# Altium project PCB.PrjPcb
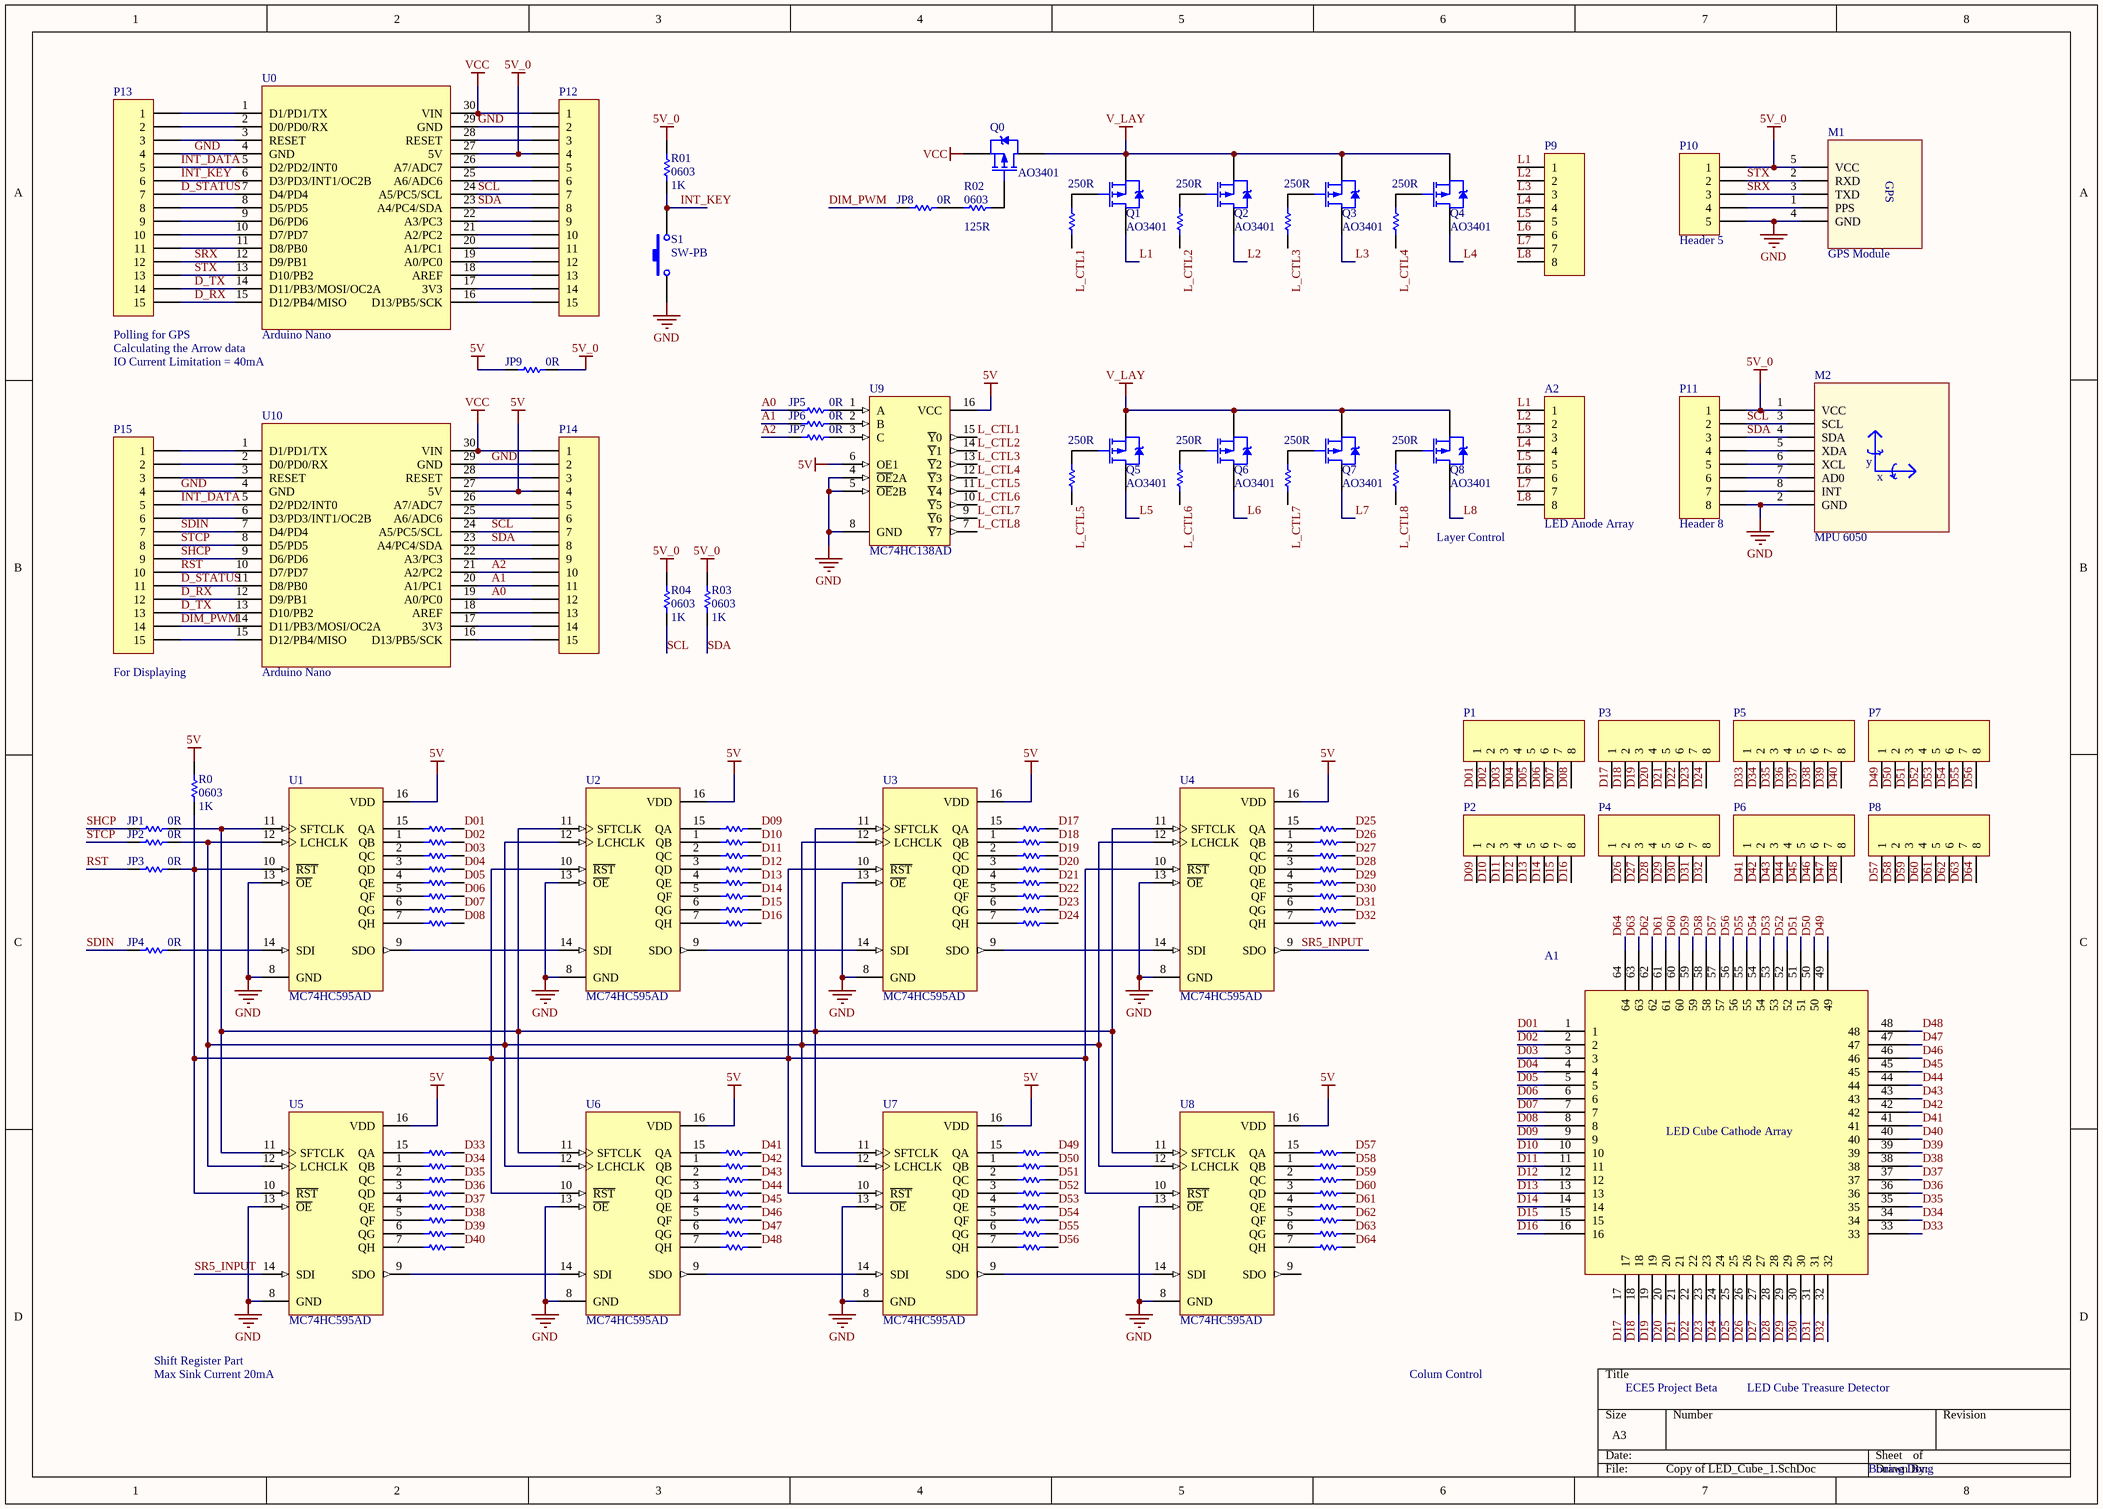
[diagram p0: Copy of LED_Cube_1.SchDoc]
1 sheet, 126 parts. Net scope: global (net labels, ports and power ports of the same name join across sheets).

## Sheet Copy of LED_Cube_1.SchDoc
size A3

### Parts
A1  LED Cube Cathode Array
A2  LED Anode Array  [HDR1X8]
JP1  value 0R  [AXIAL-0.3]  (hidden comment: 0603)
JP2  value 0R  [AXIAL-0.3]  (hidden comment: 0603)
JP3  value 0R  [AXIAL-0.3]  (hidden comment: 0603)
JP4  value 0R  [AXIAL-0.3]  (hidden comment: 0603)
JP5  value 0R  [AXIAL-0.3]  (hidden comment: 0603)
JP6  value 0R  [AXIAL-0.3]  (hidden comment: 0603)
JP7  value 0R  [AXIAL-0.3]  (hidden comment: 0603)
JP8  value 0R  [AXIAL-0.3]  (hidden comment: 0603)
JP9  value 0R  [AXIAL-0.3]  (hidden comment: 0603)
M1  GPS Module
M2  MPU 6050
P1  Header 8  [HDR1X8]  (value not drawn)
P2  Header 8  [HDR1X8]  (value not drawn)
P3  Header 8  [HDR1X8]  (value not drawn)
P4  Header 8  [HDR1X8]  (value not drawn)
P5  Header 8  [HDR1X8]  (value not drawn)
P6  Header 8  [HDR1X8]  (value not drawn)
P7  Header 8  [HDR1X8]  (value not drawn)
P8  Header 8  [HDR1X8]  (value not drawn)
P9  Header 8  [HDR1X8]  (value not drawn)
P10  Header 5  [HDR1X5]
P11  Header 8  [HDR1X8]
P12  Header 15  [HDR1X15]  (value not drawn)
P13  Header 15  [HDR1X15]  (value not drawn)
P14  Header 15  [HDR1X15]  (value not drawn)
P15  Header 15  [HDR1X15]  (value not drawn)
Q0  AO3401  [TO-220AB]
Q1  AO3401  [TO-220AB]
Q2  AO3401  [TO-220AB]
Q3  AO3401  [TO-220AB]
Q4  AO3401  [TO-220AB]
Q5  AO3401  [TO-220AB]
Q6  AO3401  [TO-220AB]
Q7  AO3401  [TO-220AB]
Q8  AO3401  [TO-220AB]
R0  0603  value 1K  [AXIAL-0.3]
R1  0603  [AXIAL-0.3]  (value not drawn)
R01  0603  value 1K  [AXIAL-0.3]
R2  0603  [AXIAL-0.3]  (value not drawn)
R02  0603  value 125R  [AXIAL-0.3]
R3  0603  [AXIAL-0.3]  (value not drawn)
R03  0603  value 1K  [AXIAL-0.3]
R4  0603  [AXIAL-0.3]  (value not drawn)
R04  0603  value 1K  [AXIAL-0.3]
R5  0603  [AXIAL-0.3]  (value not drawn)
R6  0603  [AXIAL-0.3]  (value not drawn)
R7  0603  [AXIAL-0.3]  (value not drawn)
R8  0603  [AXIAL-0.3]  (value not drawn)
R9  0603  [AXIAL-0.3]  (value not drawn)
R10  0603  [AXIAL-0.3]  (value not drawn)
R11  0603  [AXIAL-0.3]  (value not drawn)
R12  0603  [AXIAL-0.3]  (value not drawn)
R13  0603  [AXIAL-0.3]  (value not drawn)
R14  0603  [AXIAL-0.3]  (value not drawn)
R15  0603  [AXIAL-0.3]  (value not drawn)
R16  0603  [AXIAL-0.3]  (value not drawn)
R17  0603  [AXIAL-0.3]  (value not drawn)
R18  0603  [AXIAL-0.3]  (value not drawn)
R19  0603  [AXIAL-0.3]  (value not drawn)
R20  0603  [AXIAL-0.3]  (value not drawn)
R21  0603  [AXIAL-0.3]  (value not drawn)
R22  0603  [AXIAL-0.3]  (value not drawn)
R23  0603  [AXIAL-0.3]  (value not drawn)
R24  0603  [AXIAL-0.3]  (value not drawn)
R25  0603  [AXIAL-0.3]  (value not drawn)
R26  0603  [AXIAL-0.3]  (value not drawn)
R27  0603  [AXIAL-0.3]  (value not drawn)
R28  0603  [AXIAL-0.3]  (value not drawn)
R29  0603  [AXIAL-0.3]  (value not drawn)
R30  0603  [AXIAL-0.3]  (value not drawn)
R31  0603  [AXIAL-0.3]  (value not drawn)
R32  0603  [AXIAL-0.3]  (value not drawn)
R33  0603  [AXIAL-0.3]  (value not drawn)
R34  0603  [AXIAL-0.3]  (value not drawn)
R35  0603  [AXIAL-0.3]  (value not drawn)
R36  0603  [AXIAL-0.3]  (value not drawn)
R37  0603  [AXIAL-0.3]  (value not drawn)
R38  0603  [AXIAL-0.3]  (value not drawn)
R39  0603  [AXIAL-0.3]  (value not drawn)
R40  0603  [AXIAL-0.3]  (value not drawn)
R41  0603  [AXIAL-0.3]  (value not drawn)
R42  0603  [AXIAL-0.3]  (value not drawn)
R43  0603  [AXIAL-0.3]  (value not drawn)
R44  0603  [AXIAL-0.3]  (value not drawn)
R45  0603  [AXIAL-0.3]  (value not drawn)
R46  0603  [AXIAL-0.3]  (value not drawn)
R47  0603  [AXIAL-0.3]  (value not drawn)
R48  0603  [AXIAL-0.3]  (value not drawn)
R49  0603  [AXIAL-0.3]  (value not drawn)
R50  0603  [AXIAL-0.3]  (value not drawn)
R51  0603  [AXIAL-0.3]  (value not drawn)
R52  0603  [AXIAL-0.3]  (value not drawn)
R53  0603  [AXIAL-0.3]  (value not drawn)
R54  0603  [AXIAL-0.3]  (value not drawn)
R55  0603  [AXIAL-0.3]  (value not drawn)
R56  0603  [AXIAL-0.3]  (value not drawn)
R57  0603  [AXIAL-0.3]  (value not drawn)
R58  0603  [AXIAL-0.3]  (value not drawn)
R59  0603  [AXIAL-0.3]  (value not drawn)
R60  0603  [AXIAL-0.3]  (value not drawn)
R61  0603  [AXIAL-0.3]  (value not drawn)
R62  0603  [AXIAL-0.3]  (value not drawn)
R63  0603  [AXIAL-0.3]  (value not drawn)
R64  0603  [AXIAL-0.3]  (value not drawn)
Rl1  value 250R  [AXIAL-0.3]  (hidden comment: 0603)
Rl2  value 250R  [AXIAL-0.3]  (hidden comment: 0603)
Rl3  value 250R  [AXIAL-0.3]  (hidden comment: 0603)
Rl4  value 250R  [AXIAL-0.3]  (hidden comment: 0603)
Rl5  value 250R  [AXIAL-0.3]  (hidden comment: 0603)
Rl6  value 250R  [AXIAL-0.3]  (hidden comment: 0603)
Rl7  value 250R  [AXIAL-0.3]  (hidden comment: 0603)
Rl8  value 250R  [AXIAL-0.3]  (hidden comment: 0603)
S1  SW-PB  [SPST-2]
U0  Arduino Nano
U1  MC74HC595AD  [751B-05_N]
U2  MC74HC595AD  [751B-05_N]
U3  MC74HC595AD  [751B-05_N]
U4  MC74HC595AD  [751B-05_N]
U5  MC74HC595AD  [751B-05_N]
U6  MC74HC595AD  [751B-05_N]
U7  MC74HC595AD  [751B-05_N]
U8  MC74HC595AD  [751B-05_N]
U9  MC74HC138AD  [751B-05_N]
U10  Arduino Nano

### Nets
5V: JP9.2 P14.4 R0.2 U1.16(VDD) U2.16(VDD) U3.16(VDD) U4.16(VDD) U5.16(VDD) U6.16(VDD) U7.16(VDD) U8.16(VDD) U9.6(OE1) U9.16(VCC) U10.27(5V)
5V_0: JP9.1 M1.5(VCC) M2.1(VCC) P10.1 P11.1 P12.4 R01.2 R03.2 R04.2 U0.27(5V)
GND: M1.4(GND) M2.2(GND) P10.5 P11.8 P12.2 P13.4 P14.2 P15.4 S1.1 U0.4(GND) U0.29(GND) U1.8(GND) U1.13(~{OE}) U2.8(GND) U2.13(~{OE}) U3.8(GND) U3.13(~{OE}) U4.8(GND) U4.13(~{OE}) U5.8(GND) U5.13(~{OE}) U6.8(GND) U6.13(~{OE}) U7.8(GND) U7.13(~{OE}) U8.8(GND) U8.13(~{OE}) U9.4(~{OE}2A) U9.5(~{OE}2B) U9.8(GND) U10.4(GND) U10.29(GND)
V_LAY: Q0.2(D) Q1.3(S) Q2.3(S) Q3.3(S) Q4.3(S) Q5.3(S) Q6.3(S) Q7.3(S) Q8.3(S)
VCC: P12.1 P14.1 Q0.3(S) U0.30(VIN) U10.30(VIN)
A0: JP5.2 P14.12 U10.19(A0/PC0)
A1: JP6.2 P14.11 U10.20(A1/PC1)
A2: JP7.2 P14.10 U10.21(A2/PC2)
D01: A1.1 P1.1 R1.1
D02: A1.2 P1.2 R2.1
D03: A1.3 P1.3 R3.1
D04: A1.4 P1.4 R4.1
D05: A1.5 P1.5 R5.1
D06: A1.6 P1.6 R6.1
D07: A1.7 P1.7 R7.1
D08: A1.8 P1.8 R8.1
D09: A1.9 P2.1 R9.1
D10: A1.10 P2.2 R10.1
D11: A1.11 P2.3 R11.1
D12: A1.12 P2.4 R12.1
D13: A1.13 P2.5 R13.1
D14: A1.14 P2.6 R14.1
D15: A1.15 P2.7 R15.1
D16: A1.16 P2.8 R16.1
D17: A1.17 P3.1 R17.1
D18: A1.18 P3.2 R18.1
D19: A1.19 P3.3 R19.1
D20: A1.20 P3.4 R20.1
D21: A1.21 P3.5 R21.1
D22: A1.22 P3.6 R22.1
D23: A1.23 P3.7 R23.1
D24: A1.24 P3.8 R24.1
D25: A1.25 R25.1
D26: A1.26 P4.2 R26.1
D27: A1.27 P4.3 R27.1
D28: A1.28 P4.4 R28.1
D29: A1.29 P4.5 R29.1
D30: A1.30 P4.6 R30.1
D31: A1.31 P4.7 R31.1
D32: A1.32 P4.8 R32.1
D33: A1.33 P5.1 R33.1
D34: A1.34 P5.2 R34.1
D35: A1.35 P5.3 R35.1
D36: A1.36 P5.4 R36.1
D37: A1.37 P5.5 R37.1
D38: A1.38 P5.6 R38.1
D39: A1.39 P5.7 R39.1
D40: A1.40 P5.8 R40.1
D41: A1.41 P6.1 R41.1
D42: A1.42 P6.2 R42.1
D43: A1.43 P6.3 R43.1
D44: A1.44 P6.4 R44.1
D45: A1.45 P6.5 R45.1
D46: A1.46 P6.6 R46.1
D47: A1.47 P6.7 R47.1
D48: A1.48 P6.8 R48.1
D49: A1.49 P7.1 R49.1
D50: A1.50 P7.2 R50.1
D51: A1.51 P7.3 R51.1
D52: A1.52 P7.4 R52.1
D53: A1.53 P7.5 R53.1
D54: A1.54 P7.6 R54.1
D55: A1.55 P7.7 R55.1
D56: A1.56 P7.8 R56.1
D57: A1.57 P8.1 R57.1
D58: A1.58 P8.2 R58.1
D59: A1.59 P8.3 R59.1
D60: A1.60 P8.4 R60.1
D61: A1.61 P8.5 R61.1
D62: A1.62 P8.6 R62.1
D63: A1.63 P8.7 R63.1
D64: A1.64 P8.8 R64.1
D_RX: P13.15 P15.12 U0.15(D12/PB4/MISO) U10.12(D9/PB1)
D_STATUS: P13.7 P15.11 U0.7(D4/PD4) U10.11(D8/PB0)
D_TX: P13.14 P15.13 U0.14(D11/PB3/MOSI/OC2A) U10.13(D10/PB2)
DIM_PWM: JP8.2 P15.14 U10.14(D11/PB3/MOSI/OC2A)
INT_DATA: P13.5 P15.5 U0.5(D2/PD2/INT0) U10.5(D2/PD2/INT0)
INT_KEY: P13.6 R01.1 S1.2 U0.6(D3/PD3/INT1/OC2B)
L1: A2.1 P9.1 Q1.2(D)
L2: A2.2 P9.2 Q2.2(D)
L3: A2.3 P9.3 Q3.2(D)
L4: A2.4 P9.4 Q4.2(D)
L5: A2.5 P9.5 Q5.2(D)
L6: A2.6 P9.6 Q6.2(D)
L7: A2.7 P9.7 Q7.2(D)
L8: A2.8 P9.8 Q8.2(D)
L_CTL1: Rl1.2 U9.15(~{Y}0)
L_CTL2: Rl2.2 U9.14(~{Y}1)
L_CTL3: Rl3.2 U9.13(~{Y}2)
L_CTL4: Rl4.2 U9.12(~{Y}3)
L_CTL5: Rl5.2 U9.11(~{Y}4)
L_CTL6: Rl6.2 U9.10(~{Y}5)
L_CTL7: Rl7.2 U9.9(~{Y}6)
L_CTL8: Rl8.2 U9.7(~{Y}7)
RST: JP3.2 P15.10 U10.10(D7/PD7)
SCL: M2.3(SCL) P11.2 P12.7 P14.7 R04.1 U0.24(A5/PC5/SCL) U10.24(A5/PC5/SCL)
SDA: M2.4(SDA) P11.3 P12.8 P14.8 R03.1 U0.23(A4/PC4/SDA) U10.23(A4/PC4/SDA)
SDIN: JP4.2 P15.7 U10.7(D4/PD4)
SHCP: JP1.2 P15.9 U10.9(D6/PD6)
SR5_INPUT: U4.9(SDO) U5.14(SDI)
SRX: M1.3(TXD) P10.3 P13.12 U0.12(D9/PB1)
STCP: JP2.2 P15.8 U10.8(D5/PD5)
STX: M1.2(RXD) P10.2 P13.13 U0.13(D10/PB2)
NetJP1_1: JP1.1 U1.11(SFTCLK) U2.11(SFTCLK) U3.11(SFTCLK) U4.11(SFTCLK) U5.11(SFTCLK) U6.11(SFTCLK) U7.11(SFTCLK) U8.11(SFTCLK)
NetJP2_1: JP2.1 U1.12(LCHCLK) U2.12(LCHCLK) U3.12(LCHCLK) U4.12(LCHCLK) U5.12(LCHCLK) U6.12(LCHCLK) U7.12(LCHCLK) U8.12(LCHCLK)
NetJP3_1: JP3.1 R0.1 U1.10(~{RST}) U2.10(~{RST}) U3.10(~{RST}) U4.10(~{RST}) U5.10(~{RST}) U6.10(~{RST}) U7.10(~{RST}) U8.10(~{RST})
NetJP4_1: JP4.1 U1.14(SDI)
NetJP5_1: JP5.1 U9.1(A)
NetJP6_1: JP6.1 U9.2(B)
NetJP7_1: JP7.1 U9.3(C)
NetJP8_1: JP8.1 R02.2
NetM1_1: M1.1(PPS) P10.4
NetM2_5: M2.5(XDA) P11.4
NetM2_6: M2.6(XCL) P11.5
NetM2_7: M2.7(AD0) P11.6
NetM2_8: M2.8(INT) P11.7
NetP12_3: P12.3 U0.28(RESET)
NetP12_5: P12.5 U0.26(A7/ADC7)
NetP12_6: P12.6 U0.25(A6/ADC6)
NetP12_9: P12.9 U0.22(A3/PC3)
NetP12_10: P12.10 U0.21(A2/PC2)
NetP12_11: P12.11 U0.20(A1/PC1)
NetP12_12: P12.12 U0.19(A0/PC0)
NetP12_13: P12.13 U0.18(AREF)
NetP12_14: P12.14 U0.17(3V3)
NetP12_15: P12.15 U0.16(D13/PB5/SCK)
NetP13_1: P13.1 U0.1(D1/PD1/TX)
NetP13_2: P13.2 U0.2(D0/PD0/RX)
NetP13_3: P13.3 U0.3(RESET)
NetP13_8: P13.8 U0.8(D5/PD5)
NetP13_9: P13.9 U0.9(D6/PD6)
NetP13_10: P13.10 U0.10(D7/PD7)
NetP13_11: P13.11 U0.11(D8/PB0)
NetP14_3: P14.3 U10.28(RESET)
NetP14_5: P14.5 U10.26(A7/ADC7)
NetP14_6: P14.6 U10.25(A6/ADC6)
NetP14_9: P14.9 U10.22(A3/PC3)
NetP14_13: P14.13 U10.18(AREF)
NetP14_14: P14.14 U10.17(3V3)
NetP14_15: P14.15 U10.16(D13/PB5/SCK)
NetP15_1: P15.1 U10.1(D1/PD1/TX)
NetP15_2: P15.2 U10.2(D0/PD0/RX)
NetP15_3: P15.3 U10.3(RESET)
NetP15_6: P15.6 U10.6(D3/PD3/INT1/OC2B)
NetP15_15: P15.15 U10.15(D12/PB4/MISO)
NetQ0_1: Q0.1(G) R02.1
NetQ1_1: Q1.1(G) Rl1.1
NetQ2_1: Q2.1(G) Rl2.1
NetQ3_1: Q3.1(G) Rl3.1
NetQ4_1: Q4.1(G) Rl4.1
NetQ5_1: Q5.1(G) Rl5.1
NetQ6_1: Q6.1(G) Rl6.1
NetQ7_1: Q7.1(G) Rl7.1
NetQ8_1: Q8.1(G) Rl8.1
NetR1_2: R1.2 U1.15(QA)
NetR2_2: R2.2 U1.1(QB)
NetR3_2: R3.2 U1.2(QC)
NetR4_2: R4.2 U1.3(QD)
NetR5_2: R5.2 U1.4(QE)
NetR6_2: R6.2 U1.5(QF)
NetR7_2: R7.2 U1.6(QG)
NetR8_2: R8.2 U1.7(QH)
NetR9_2: R9.2 U2.15(QA)
NetR10_2: R10.2 U2.1(QB)
NetR11_2: R11.2 U2.2(QC)
NetR12_2: R12.2 U2.3(QD)
NetR13_2: R13.2 U2.4(QE)
NetR14_2: R14.2 U2.5(QF)
NetR15_2: R15.2 U2.6(QG)
NetR16_2: R16.2 U2.7(QH)
NetR17_2: R17.2 U3.15(QA)
NetR18_2: R18.2 U3.1(QB)
NetR19_2: R19.2 U3.2(QC)
NetR20_2: R20.2 U3.3(QD)
NetR21_2: R21.2 U3.4(QE)
NetR22_2: R22.2 U3.5(QF)
NetR23_2: R23.2 U3.6(QG)
NetR24_2: R24.2 U3.7(QH)
NetR25_2: R25.2 U4.15(QA)
NetR26_2: R26.2 U4.1(QB)
NetR27_2: R27.2 U4.2(QC)
NetR28_2: R28.2 U4.3(QD)
NetR29_2: R29.2 U4.4(QE)
NetR30_2: R30.2 U4.5(QF)
NetR31_2: R31.2 U4.6(QG)
NetR32_2: R32.2 U4.7(QH)
NetR33_2: R33.2 U5.15(QA)
NetR34_2: R34.2 U5.1(QB)
NetR35_2: R35.2 U5.2(QC)
NetR36_2: R36.2 U5.3(QD)
NetR37_2: R37.2 U5.4(QE)
NetR38_2: R38.2 U5.5(QF)
NetR39_2: R39.2 U5.6(QG)
NetR40_2: R40.2 U5.7(QH)
NetR41_2: R41.2 U6.15(QA)
NetR42_2: R42.2 U6.1(QB)
NetR43_2: R43.2 U6.2(QC)
NetR44_2: R44.2 U6.3(QD)
NetR45_2: R45.2 U6.4(QE)
NetR46_2: R46.2 U6.5(QF)
NetR47_2: R47.2 U6.6(QG)
NetR48_2: R48.2 U6.7(QH)
NetR49_2: R49.2 U7.15(QA)
NetR50_2: R50.2 U7.1(QB)
NetR51_2: R51.2 U7.2(QC)
NetR52_2: R52.2 U7.3(QD)
NetR53_2: R53.2 U7.4(QE)
NetR54_2: R54.2 U7.5(QF)
NetR55_2: R55.2 U7.6(QG)
NetR56_2: R56.2 U7.7(QH)
NetR57_2: R57.2 U8.15(QA)
NetR58_2: R58.2 U8.1(QB)
NetR59_2: R59.2 U8.2(QC)
NetR60_2: R60.2 U8.3(QD)
NetR61_2: R61.2 U8.4(QE)
NetR62_2: R62.2 U8.5(QF)
NetR63_2: R63.2 U8.6(QG)
NetR64_2: R64.2 U8.7(QH)
NetU1_9: U1.9(SDO) U2.14(SDI)
NetU2_9: U2.9(SDO) U3.14(SDI)
NetU3_9: U3.9(SDO) U4.14(SDI)
NetU5_9: U5.9(SDO) U6.14(SDI)
NetU6_9: U6.9(SDO) U7.14(SDI)
NetU7_9: U7.9(SDO) U8.14(SDI)

Not connected (* = marked no-connect by the designer): P4 1; U8 9(SDO)

### Notes on the sheet
- (near P13) Polling for GPS
- IO Current Limitation = 40mA
- Calculating the Arrow data
- Layer Control
- (near P15) For Displaying
- Shift Register Part
- Max Sink Current 20mA
- Colum Control
- ECE5 Project Beta
- LED Cube Treasure Detector
- Boning Dong
- (in symbol GPS Module) GPS
- (in symbol MPU6050) y; x

### Library data of the parts
A1 = Cathode_Array
A2 P1-P9 P11 = Header 8: Header, 8-Pin; LatestRevisionDate: 17-Jul-2002; LatestRevisionNote: Re-released for DXP Platform.; Publisher: Altium Limited
JP1-JP9 R0 R01 R02 R03 R04 Rl1-Rl8 = Res1: Resistor; Published: 8-Jun-2000; LatestRevisionDate: 17-Jul-2002; LatestRevisionNote: Re-released for DXP Platform.; PackageReference: AXIAL-0.3; Publisher: Altium Limited; PackageDescription: Axial Device, Thru-Hole; 2 Leads; 0.3 in Pin Spacing
M2 = MPU6050
P10 = Header 5: Header, 5-Pin; LatestRevisionDate: 17-Jul-2002; LatestRevisionNote: Re-released for DXP Platform.; Publisher: Altium Limited
P12-P15 = Header 15: Header, 15-Pin; LatestRevisionDate: 17-Jul-2002; LatestRevisionNote: Re-released for DXP Platform.; Publisher: Altium Limited
Q0-Q8 = PMOS-2: P-Channel Power MOSFET; Note: Pin 4 not drawn and electrically connected to Pin 2.; Published: 8-Jun-2000; LatestRevisionDate: 17-Jul-2002; LatestRevisionNote: Re-released for DXP Platform.; DatasheetVersion: PD-9.390D; PackageVersion: Feb-1997; PackageReference: TO-220AB; Publisher: Altium Limited; PackageDescription: TO, Thru-Hole, Vertical, Heatsink Mounted; 3 In-Line Leads; Pitch 2.54 mm; ComponentLink1Description: Manufacturer Link; ComponentLink1URL: http://www.irf.com/
R1-R64 = Res1: Resistor; Value: 125R; Published: 8-Jun-2000; LatestRevisionDate: 17-Jul-2002; LatestRevisionNote: Re-released for DXP Platform.; PackageReference: AXIAL-0.3; Publisher: Altium Limited; PackageDescription: Axial Device, Thru-Hole; 2 Leads; 0.3 in Pin Spacing
S1 = SW-PB: Switch; Published: 24-Mar-1999; LatestRevisionDate: 17-Jul-2002; LatestRevisionNote: Re-released for DXP Platform.; PackageReference: SPST-2; Publisher: Altium Limited; PackageDescription: Switch; 2 Leads
U1-U8 = MC74HC595AD: 8-Bit Serial-Input/Serial or Prallel-Output Shift Register with Latched 3-State Outputs; Published: 15-Apr-2002; LatestRevisionDate: 13-Apr-2006; LatestRevisionNote: IPC-7351 Footprint Added.; DatasheetVersion: Mar-2000; PackageVersion: Oct-1999; PackageReference: 751B-05; Publisher: Altium Limited; PackageDescription: 16-Pin Small Outline Integrated Circuit 1.27 mm Pitch; Code_JEDEC: MS-012-AC; Code_IPC: SOIC127P600-16; ComponentLink1Description: Manufacturer Link; ComponentLink1URL: http://www.onsemi.com/; ComponentLink2Description: Datasheet; ComponentLink2URL: http://www.onsemi.com/pub/Collateral/MC74HC595A-D.PDF
U9 = MC74HC138AD: 1-of-8 Decoder/Demultiplexer; Published: 15-Apr-2002; LatestRevisionDate: 13-Apr-2006; LatestRevisionNote: IPC-7351 Footprint Added.; DatasheetVersion: Mar-2000; PackageVersion: Oct-1999; PackageReference: 751B-05; Publisher: Altium Limited; PackageDescription: 16-Pin Small Outline Integrated Circuit 1.27 mm Pitch; Code_JEDEC: MS-012-AC; Code_IPC: SOIC127P600-16; ComponentLink1Description: Manufacturer Link; ComponentLink1URL: http://www.onsemi.com/; ComponentLink2Description: Datasheet; ComponentLink2URL: http://www.onsemi.com/pub/Collateral/MC74HC138A-D.PDF